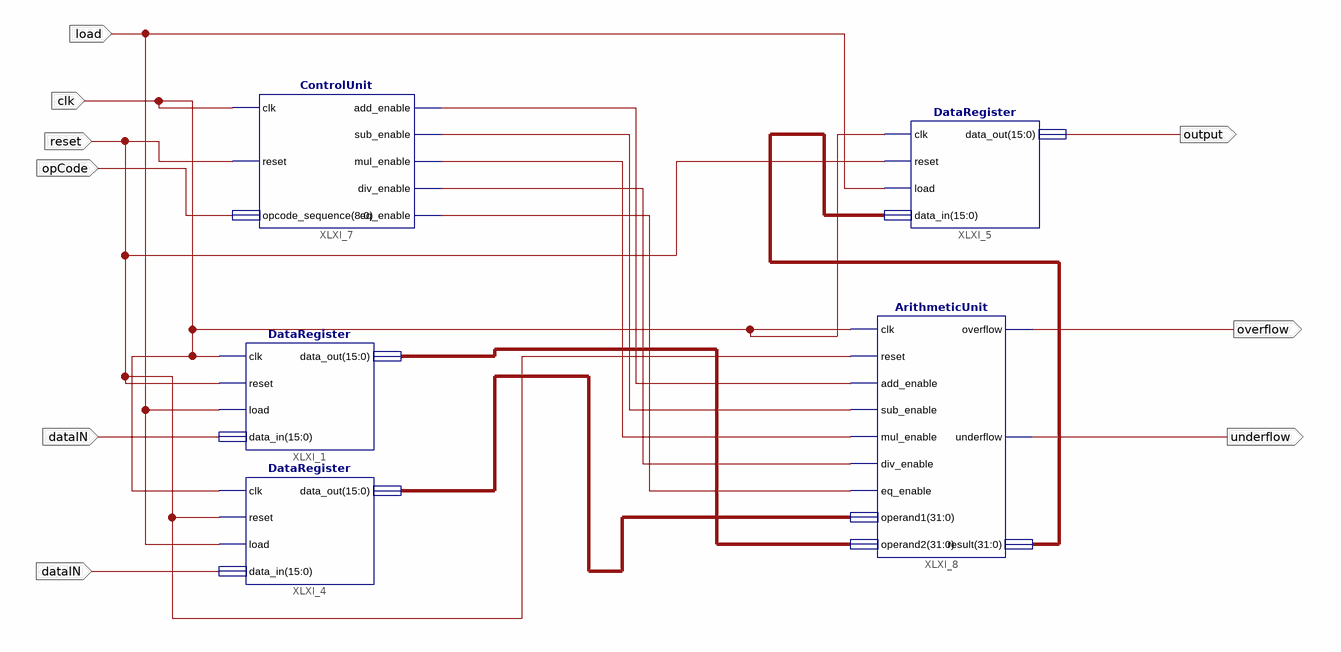
[diagram p0: schematic sheet 1]
// Xilinx ISE schematic CPU.sch (artix7) as structural Verilog: 5 symbols, 8 ports
module CPU (
  input  opCode,
  input  dataIN,
  input  load,
  input  clk,
  input  reset,
  output \output ,
  output overflow,
  output underflow
);

  wire XLXN_28, XLXN_33, XLXN_34, XLXN_35, XLXN_36;
  wire [15:0] XLXN_10, XLXN_13, XLXN_14;

  DataRegister XLXI_1 (.clk(clk), .reset(reset), .load(load), .data_in({16{dataIN}}), .data_out(XLXN_10));
  DataRegister XLXI_4 (.clk(clk), .reset(reset), .load(load), .data_in({16{dataIN}}), .data_out(XLXN_13));
  DataRegister XLXI_5 (.clk(clk), .reset(reset), .load(load), .data_in(XLXN_14), .data_out({16{\output }}));
  ControlUnit XLXI_7 (
    .clk(clk), .reset(reset), .opcode_sequence({9{opCode}}), .add_enable(XLXN_33), .sub_enable(XLXN_34),
    .mul_enable(XLXN_35), .div_enable(XLXN_28), .eq_enable(XLXN_36));
  ArithmeticUnit XLXI_8 (
    .clk(clk), .reset(reset), .add_enable(XLXN_33), .sub_enable(XLXN_34), .mul_enable(XLXN_35),
    .div_enable(XLXN_28), .eq_enable(XLXN_36), .operand1(XLXN_13), .operand2(XLXN_10), .overflow(overflow),
    .underflow(underflow), .result(XLXN_14));
endmodule
